# Altium schematic sheet STM32F103T8.SchDoc
size A3; Revision: 10
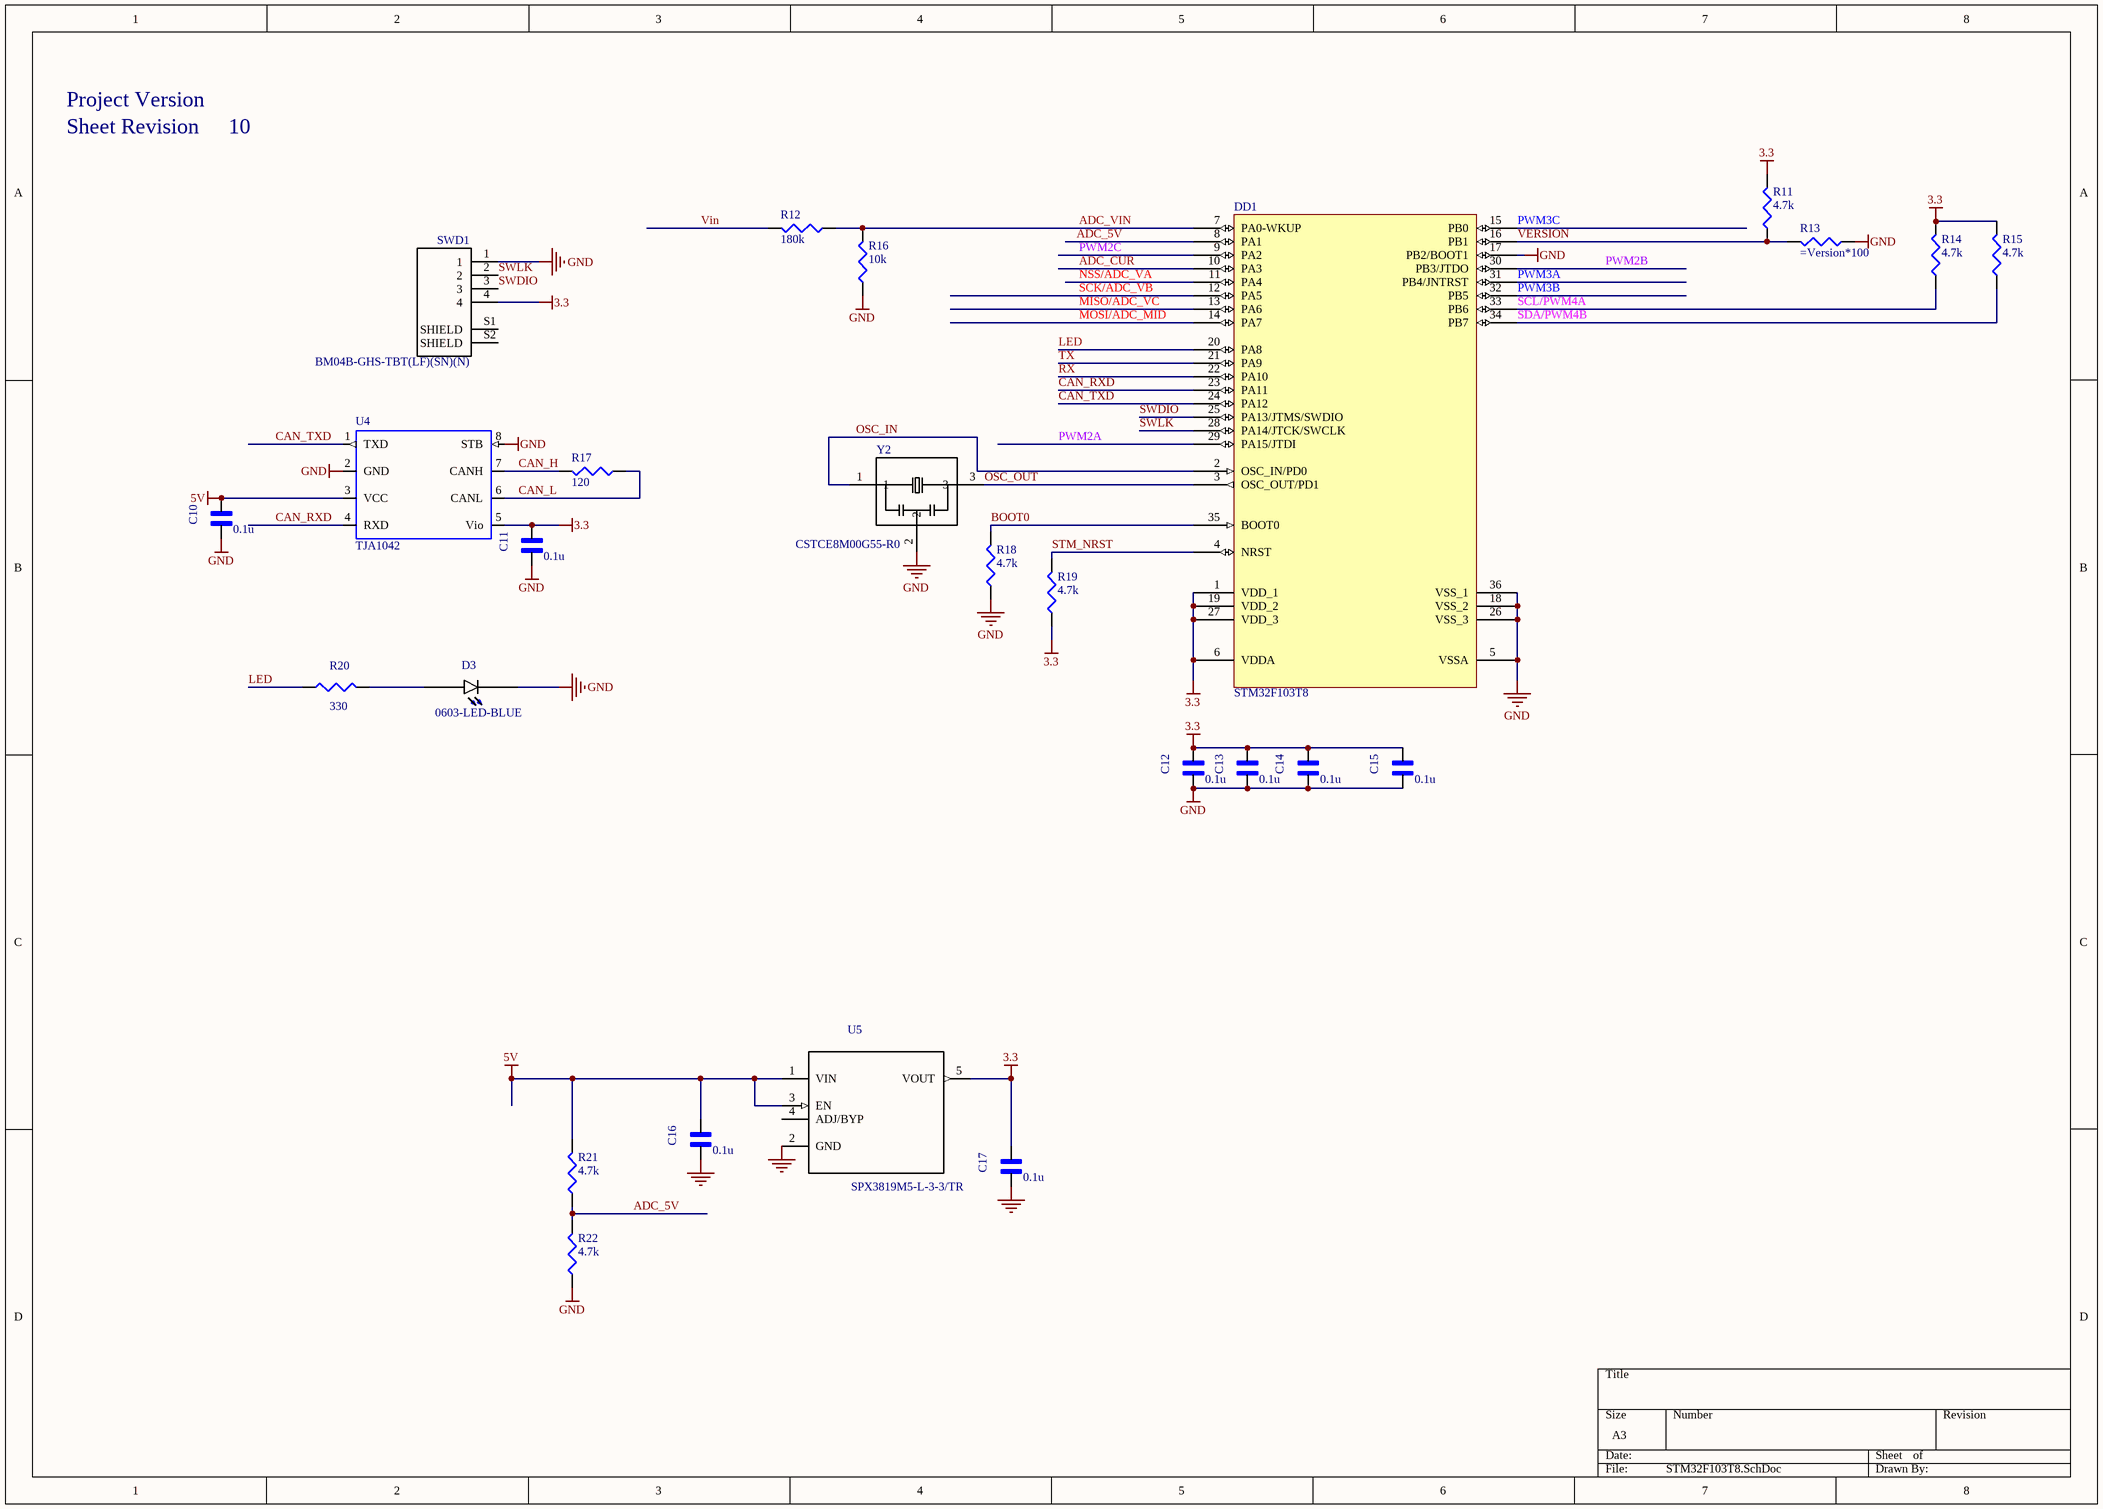
[diagram p0: STM32F103T8.SchDoc]

## Parts
C10  value 0.1u  [*CAPC1608X90]  (hidden comment: GX035C104MAT2-500)
C11  value 0.1u  [*CAPC1608X90]  (hidden comment: GX035C104MAT2-500)
C12  value 0.1u  [*CAPC1608X90]  (hidden comment: GX035C104MAT2-500)
C13  value 0.1u  [*CAPC1608X90]  (hidden comment: GX035C104MAT2-500)
C14  value 0.1u  [*CAPC1608X90]  (hidden comment: GX035C104MAT2-500)
C15  value 0.1u  [*CAPC1608X90]  (hidden comment: GX035C104MAT2-500)
C16  value 0.1u  [*CAPC1608X90]  (hidden comment: GX035C104MAT2-500)
C17  value 0.1u  [*CAPC1608X90]  (hidden comment: GX035C104MAT2-500)
D3  0603-LED-BLUE  [*LEDM1608X80_LTE-C1906R-14(Primary)]
DD1  STM32F103T8  [*QFN50P600X600X100-37N]
R11  value 4.7k  [J1-0603]  (hidden comment: Res3)
R12  value 180k  [J1-0603]  (hidden comment: Res3)
R13  Res3  [J1-0603]  (value not drawn)
R14  value 4.7k  [J1-0603]  (hidden comment: Res3)
R15  value 4.7k  [J1-0603]  (hidden comment: Res3)
R16  value 10k  [J1-0603]  (hidden comment: Res3)
R17  value 120  [J1-0603]  (hidden comment: Res3)
R18  value 4.7k  [J1-0603]  (hidden comment: Res3)
R19  value 4.7k  [J1-0603]  (hidden comment: Res3)
R20  value 330  [J1-0603]  (hidden comment: Res3)
R21  value 4.7k  [J1-0603]  (hidden comment: Res3)
R22  value 4.7k  [J1-0603]  (hidden comment: Res3)
SWD1  BM04B-GHS-TBT(LF)(SN)(N)  [JST_BM04B-GHS-holes]
U4  TJA1042  [SOT782-1]
U5  SPX3819M5-L-3-3/TR  [*SOT95P280X145-5N]
Y2  CSTCE8M00G55-R0  [*OSC_CSTCE8M00G55-R0]

## Nets
3.3: C11.1 C12.1 C13.1 C14.1 C15.1 C17.1 DD1.1(VDD_1) DD1.6(VDDA) DD1.19(VDD_2) DD1.27(VDD_3) R11.2 R14.2 R15.2 R19.1 SWD1.4 U4.5(Vio) U5.5(VOUT)
5V: C10.1 C16.1 R21.2 U4.3(VCC) U5.1(VIN) U5.3(EN)
GND: C10.2 C11.2 C12.2 C13.2 C14.2 C15.2 C16.2 C17.2 D3.C DD1.5(VSSA) DD1.17(PB2/BOOT1) DD1.18(VSS_2) DD1.26(VSS_3) DD1.36(VSS_1) R13.1 R16.1 R18.1 R22.1 SWD1.1 U4.2(GND) U4.8(STB) U5.2(GND) Y2.2
ADC_5V: DD1.8(PA1) R21.1 R22.2
ADC_CUR: DD1.10(PA3)
ADC_VIN: DD1.7(PA0-WKUP) R12.1 R16.2
BOOT0: DD1.35(BOOT0) R18.2
CAN_H: R17.2 U4.7(CANH)
CAN_L: R17.1 U4.6(CANL)
CAN_RXD: DD1.23(PA11) U4.4(RXD)
CAN_TXD: DD1.24(PA12) U4.1(TXD)
LED: DD1.20(PA8) R20.1
MISO/ADC_VC: DD1.13(PA6)
MOSI/ADC_MID: DD1.14(PA7)
NSS/ADC_VA: DD1.11(PA4)
OSC_IN: DD1.2(OSC_IN/PD0) Y2.1
OSC_OUT: DD1.3(OSC_OUT/PD1) Y2.3
PWM2A: DD1.29(PA15/JTDI)
PWM2B: DD1.30(PB3/JTDO)
PWM2C: DD1.9(PA2)
PWM3A: DD1.31(PB4/JNTRST)
PWM3B: DD1.32(PB5)
PWM3C: DD1.15(PB0)
RX: DD1.22(PA10)
SCK/ADC_VB: DD1.12(PA5)
SCL/PWM4A: DD1.33(PB6) R14.1
SDA/PWM4B: DD1.34(PB7) R15.1
STM_NRST: DD1.4(NRST) R19.2
SWDIO: DD1.25(PA13/JTMS/SWDIO) SWD1.3
SWLK: DD1.28(PA14/JTCK/SWCLK) SWD1.2
TX: DD1.21(PA9)
VERSION: DD1.16(PB1) R11.1 R13.2
Vin: R12.2
NetD3_A: D3.A R20.2

Not connected (* = marked no-connect by the designer): SWD1 S1(SHIELD) S2(SHIELD); U5 4(ADJ/BYP)

## Notes on the sheet
- Project Version
- Sheet Revision

## Library data of the parts
C10-C17 = GX035C104MAT2-500: Cap Thin Film 0.1uf 50v 0603; MF: AVX; Pacage Metric: 1608; Type: SMD; Package: 0603 AVX; MP: GX035C104MAT2-500; SnapEDA_Link: https://www.snapeda.com/parts/GX035C104MAT2-500/AVX/view-part/?ref=snap
D3 = LTE-C1906R-14: LED IrLED Chip LED 2-Pin SMD T/R; Package: 0603 Lite-On; MP: 0603-LED-BLUE; SnapEDA_Link: https://www.snapeda.com/parts/LTE-C1906R-14/Lite-On%20Inc./view-part/?ref=snap; Value: *; Type: SMD
DD1 = STM32F103T8: STM32F103T8U6, Микроконтроллер 32BIT ARM 64K FLASH [VFQFPN-36]; MF: STM; ChipDip_Link: https://www.chipdip.ru/product/stm32f103t8u6-2; HelpURL: http://www.st.com/stonline/products/literature/ds/13587.pdf; MP: STM32F103T8U6; Package: VFQFPN-36; SnapEDA_Link: https://www.snapeda.com/parts/STM32F103T8U6TR/STMicroelectronics/view-part/?ref=search&t=STM32F103T8U6; Type: SMD
R11 R13-R16 R18 R19 R21 R22 = Res3: Resistor; Pacage Metric: 1608; MP: 4.7K 1% 0603; ChipDip_Link: https://www.chipdip.ru/product0/9000079736; HelpURL: https://www.chipdip.ru/product0/9000079736; Package: R0603; Type: SMD
  R13: Value: =Version*100
R12 = Res3: Resistor; Pacage Metric: 1608; MP: 180K 1% 0603; Package: R0603; Type: SMD
R17 = Res3: 120 Ohms 1 0.1 W 1 10 W Chip Resistor 0603 1608 Metric Thick Film; Pacage Metric: 1608; MP: RC0603FR-07120RL; ChipDip_Link: https://www.chipdip.ru/product0/9000079618; HelpURL: https://www.chipdip.ru/product0/9000079618; Package: R0603; Type: SMD
R20 = Res3: Resistor; Pacage Metric: 1608; MP: RC0603FR-07330RL; ChipDip_Link: https://www.chipdip.ru/product0/9000079628; HelpURL: https://www.chipdip.ru/product0/9000079628; Package: R0603; Type: SMD
SWD1 = BM04B-GHS-TBT(LF)(SN)(N): Conn Shrouded Header HDR 4 POS 1.25mm Solder ST SMD Reel; MF: JST Sales; MP: SM04B-GHS-TB(LF)(SN); Instructions: Do not install; System: Connector; SnapEDA_Link: https://www.snapeda.com/parts/BM04B-GHS-TBT%28LF%29%28SN%29%28N%29/JST%20Sales%20America%20Inc./view-part/?ref=snap; Package: None; Value: *; Type: SMD
U4 = TJA1042: 1/1 Transceiver Half CANbus 8-SO; MF: NXP USA; SnapEDA_Link: https://www.snapeda.com/parts/TJA1042/NXP%20USA%20Inc./view-part/900919/?ref=snap; Value: *; MP: TJA1042; Package: VDFN-8 NXP USA; ChipDip_Link: https://www.chipdip.ru/product1/8002840332; HelpURL: https://static.chipdip.ru/lib/583/DOC001583059.pdf; Type: SMD
U5 = SPX3819M5-L: Low Dropout Voltage Regulator, Adjustable 0.5A, В±1%, 2.5 to 16 Vin, 5-Pin SOT-23; MF: MaxLinear, Inc.; Value: 3V3; MP: SPX3819M5-L-3-3/TR; Package: SOT-23-5 Exar; SnapEDA_Link: https://www.snapeda.com/parts/SPX3819M5-L/MaxLinear%2C%20Inc./view-part/?ref=snap; Type: SMD; ChipDip_Link: https://www.chipdip.ru/product1/8003455237; HelpURL: http://www.farnell.com/datasheets/2614478.pdf
Y2 = CSTCE8M00G55-R0: Ceramic Resonator 8MHz ??0.5% _Tol_ ??0.2% _Stability_ 33pF 40Ohm 3-Pin CSMD T/R; MF: Murata; MP: CSTCE8M00G55-R0; Package: SMD-3 Murata; SnapEDA_Link: https://www.snapeda.com/parts/CSTCE8M00G55-R0/Murata%20Electronics%20North%20America/view-part/?ref=snap; Value: *; ChipDip_Link: https://www.chipdip.ru/product1/8001783721; HelpURL: https://www.murata.com/en-eu/api/pdfdownloadapi?cate=&partno=CSTCE8M00G55-R0; Type: SMD